# EAGLE design LICL_Amplifier (EAGLE 9.2.1)
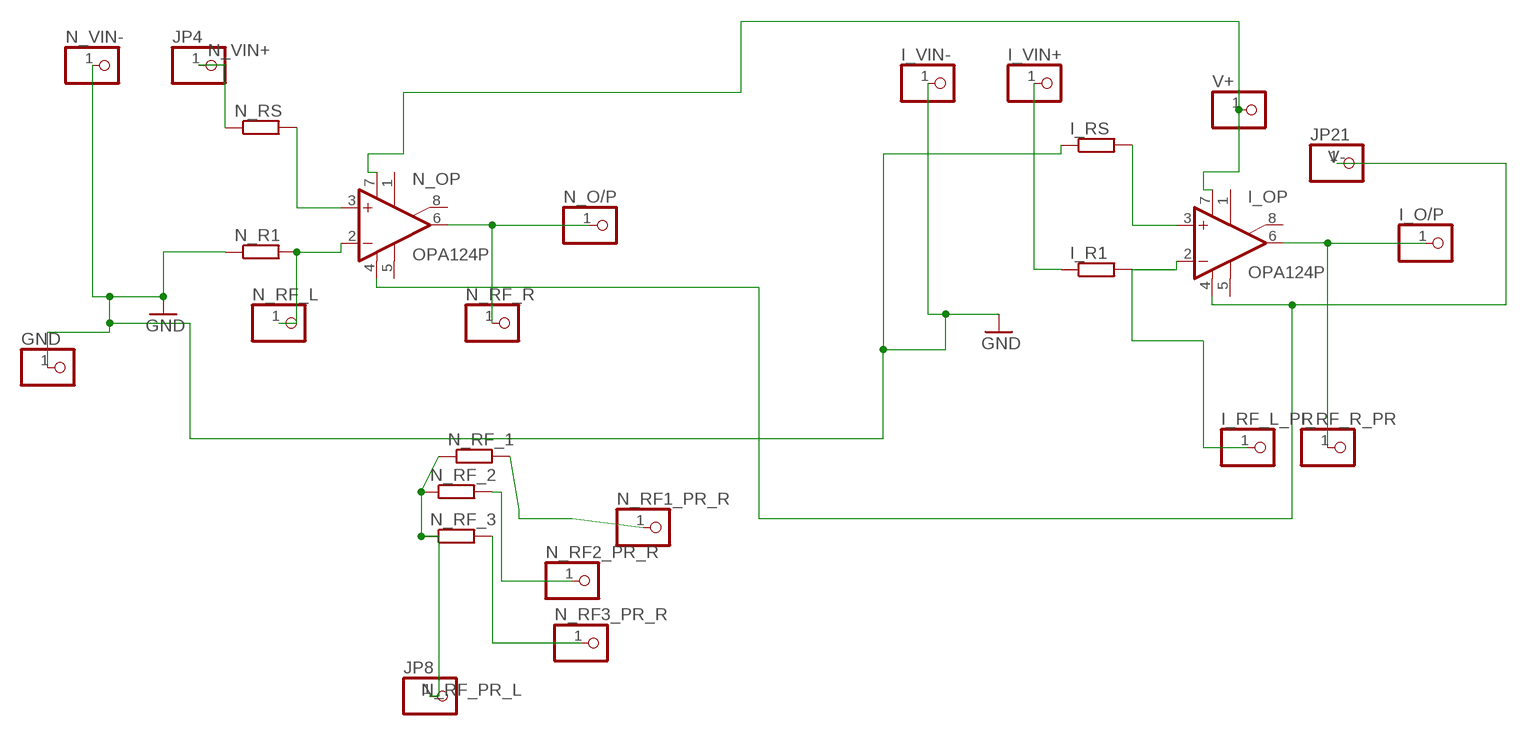
[diagram p0: schematic, sheet 1]

## Parts
GND  PINHD-1X1  [1X01]
I_O/P  PINHD-1X1  [1X01]
I_OP  OPA124P  [DIL08]
I_R1  R-EU_0207/10  [0207/10]
I_RF_L_PR  PINHD-1X1  [1X01]
I_RF_R_PR  PINHD-1X1  [1X01]
I_RS  R-EU_0207/10  [0207/10]
I_VIN+  PINHD-1X1  [1X01]
I_VIN-  PINHD-1X1  [1X01]
JP4  PINHD-1X1  [1X01]
JP8  PINHD-1X1  [1X01]
JP21  PINHD-1X1  [1X01]
N_O/P  PINHD-1X1  [1X01]
N_OP  OPA124P  [DIL08]
N_R1  R-EU_0207/10  [0207/10]
N_RF1_PR_R  PINHD-1X1  [1X01]
N_RF2_PR_R  PINHD-1X1  [1X01]
N_RF3_PR_R  PINHD-1X1  [1X01]
N_RF_1  R-EU_0207/10  [0207/10]
N_RF_2  R-EU_0207/10  [0207/10]
N_RF_3  R-EU_0207/10  [0207/10]
N_RF_L  PINHD-1X1  [1X01]
N_RF_R  PINHD-1X1  [1X01]
N_RS  R-EU_0207/10  [0207/10]
N_VIN-  PINHD-1X1  [1X01]
V+  PINHD-1X1  [1X01]

## Nets
GND: GND.1 I_RS.1 I_VIN-.1 N_R1.1 N_VIN-.1
N$1: N_OP.3(+IN) N_RS.2
N$4: N_O/P.1 N_OP.6(OUT) N_RF_R.1
N$5: N_RF1_PR_R.1 N_RF_1.2
N$6: N_RF2_PR_R.1 N_RF_2.2
N$7: N_RF3_PR_R.1 N_RF_3.2
N$8: I_OP.7(V+) N_OP.7(V+) V+.1
N$11: I_OP.3(+IN) I_RS.2
N$12: I_R1.1 I_VIN+.1
N$13: I_OP.2(-IN) I_R1.2 I_RF_L_PR.1
N$14: I_O/P.1 I_OP.6(OUT) I_RF_R_PR.1
N_RF_L: N_OP.2(-IN) N_R1.2 N_RF_L.1
N_RF_PR_L: JP8.1 N_RF_1.1 N_RF_2.1 N_RF_3.1
N_VIN+: JP4.1 N_RS.1
V-: I_OP.4(V-) JP21.1 N_OP.4(V-)
Unconnected: I_OP.1(TRIM1) I_OP.5(TRIM2) I_OP.8(SUBS) N_OP.1(TRIM1) N_OP.5(TRIM2) N_OP.8(SUBS)

## Library data of the parts
GND I_O/P I_RF_L_PR I_RF_R_PR I_VIN+ I_VIN- JP4 JP8 JP21 N_O/P N_RF1_PR_R N_RF2_PR_R N_RF3_PR_R N_RF_L N_RF_R N_VIN- V+ = pinhead:PINHD-1X1: PIN HEADER
I_OP N_OP = burr-brown:OPA124: Difet Operational Amplifier Low Noise, Precision; OC_FARNELL: unknown; OC_NEWARK: unknown
I_R1 I_RS N_R1 N_RF_1-N_RF_3 N_RS = resistor:R-EU_: RESISTOR, European symbol

## Board
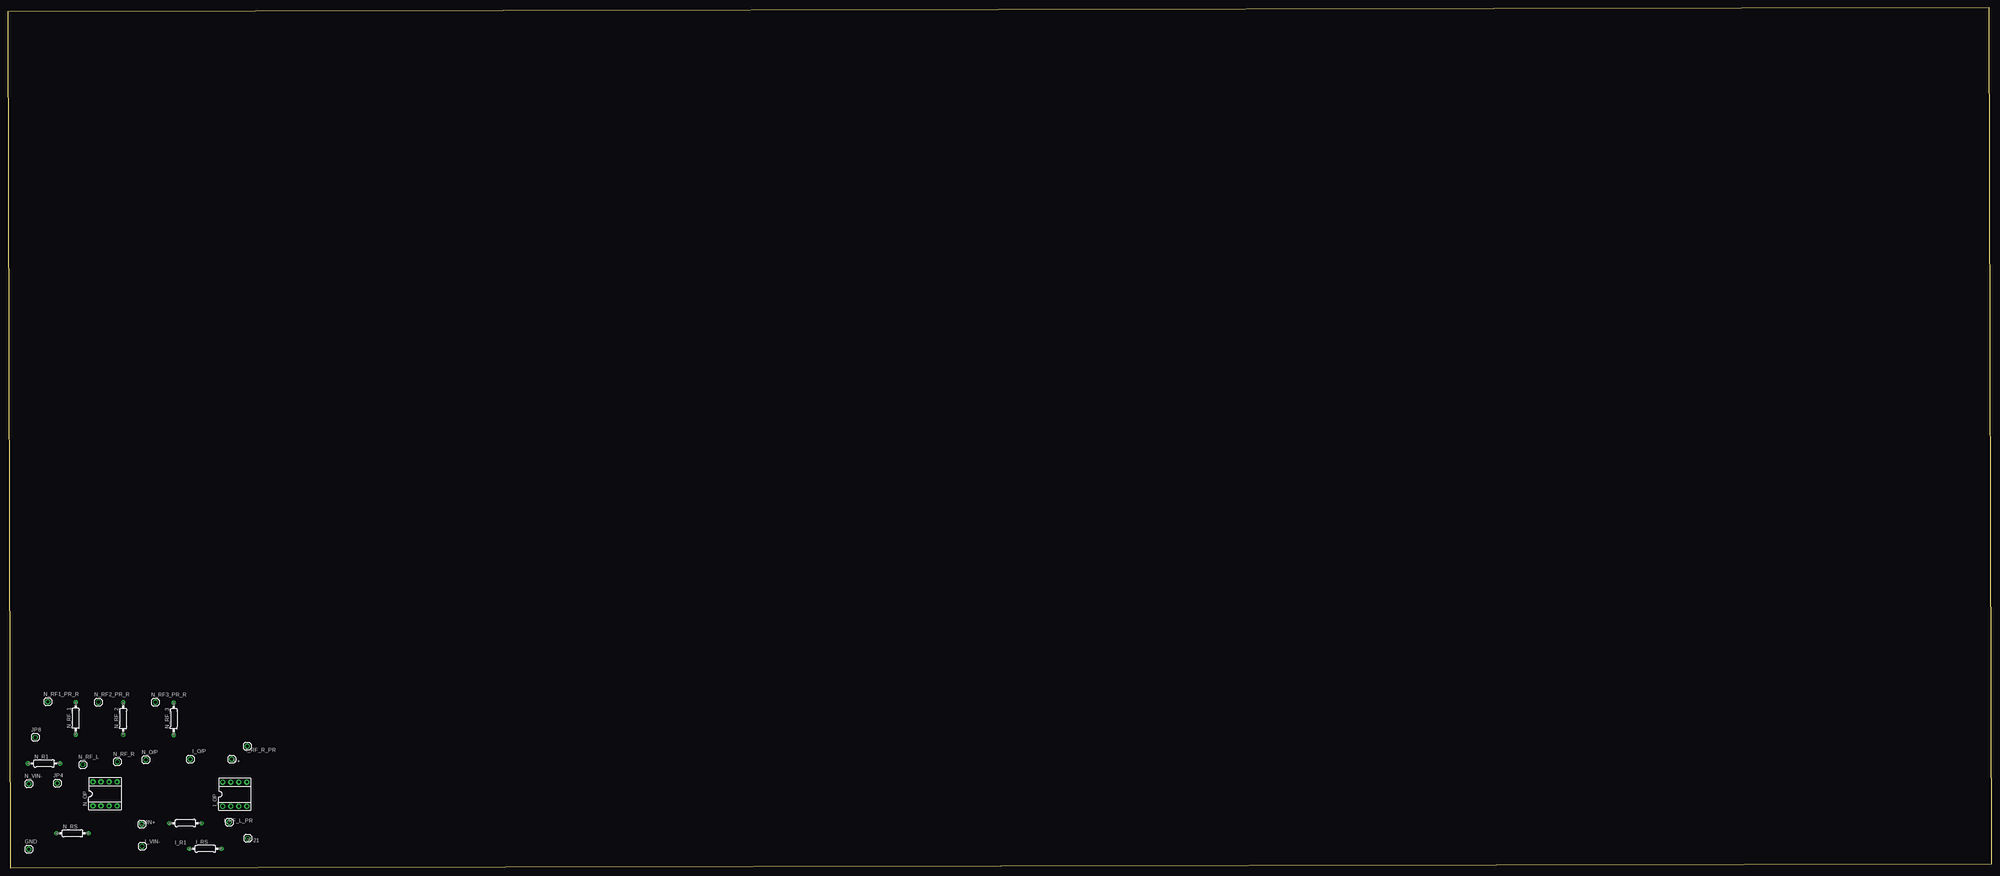
[diagram p1: board, top side]
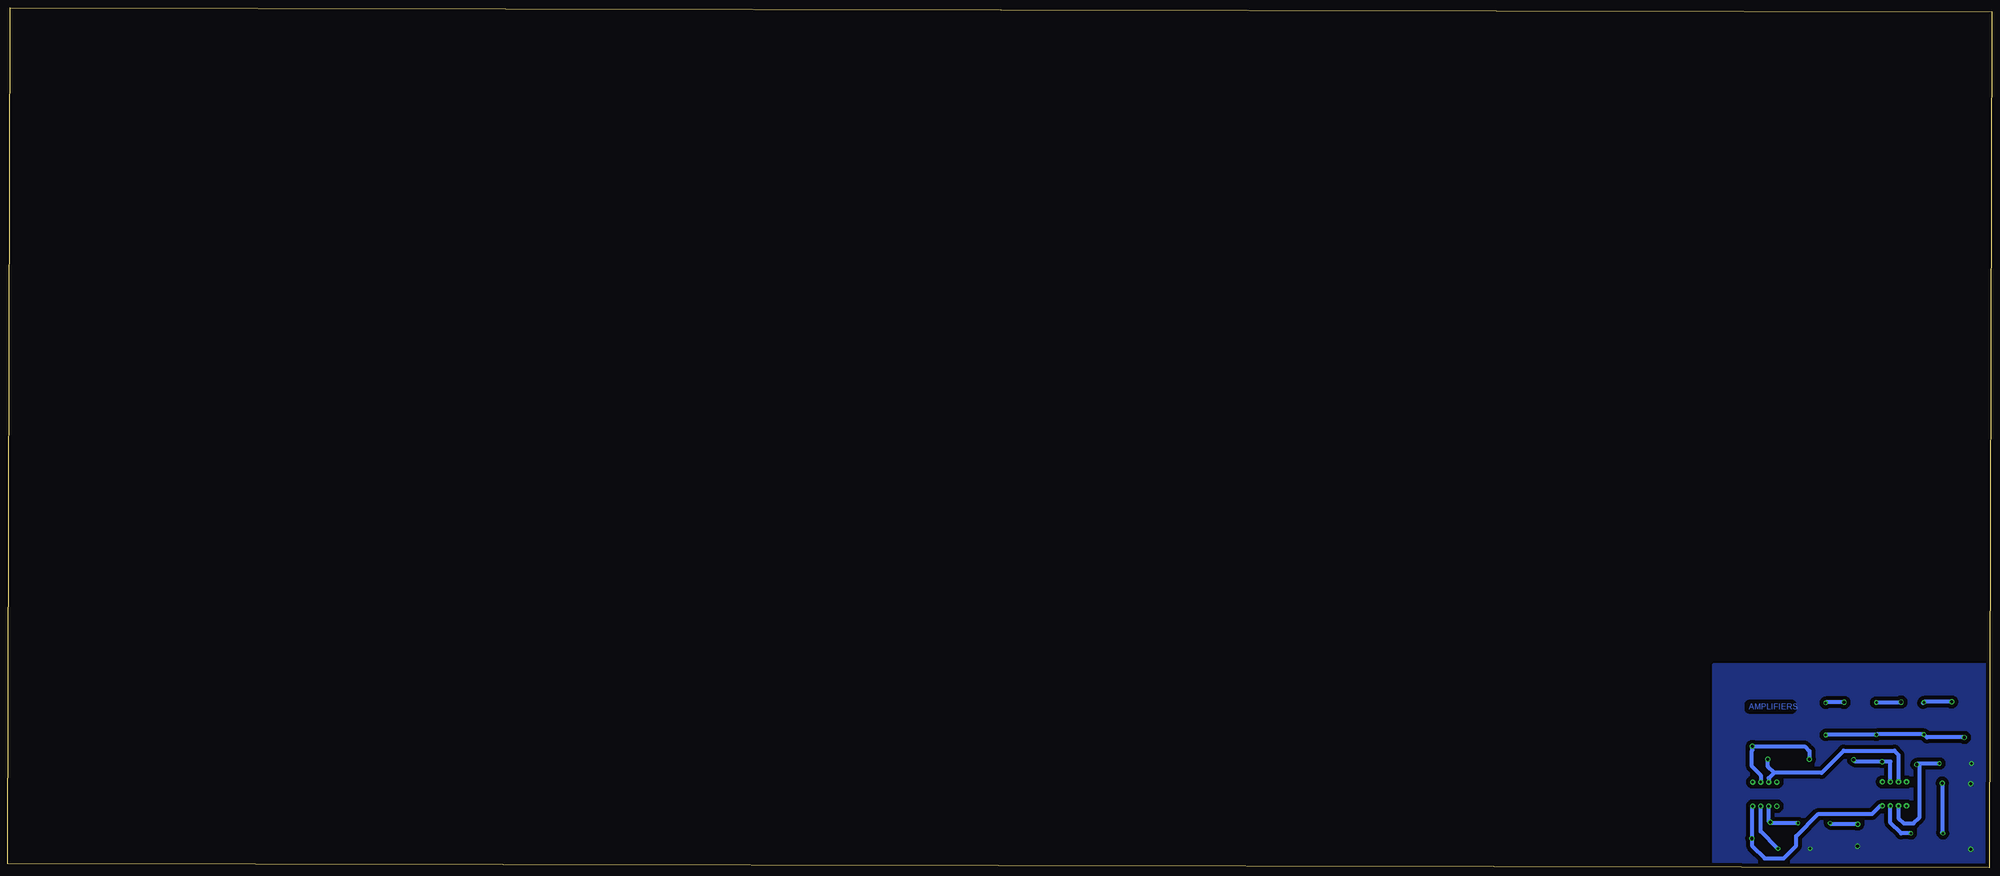
[diagram p2: board, bottom side, seen from below]

Size 626.82 x 271.64 mm. Coordinates in mm from the lower left corner, seen from the top.
Outline: 0.73,0 626.82,1.27 626.09,271.64 0,270.37 0.73,0
Copper layers (1*16): Top 0.035mm / dielectric 1.5mm / Bottom 0.035mm
Design rules "default": minimum track width 6mil, minimum drill 0.35mm, track to track 6mil, track to pad 6mil, pad to pad 6mil, via to via 6mil, smd to smd 6mil, copper to edge 40mil, drill to drill 6mil, minimum pad ring 10mil, minimum via ring 8mil, stop-mask expansion 4mil, vias tented up to drill 0mil, thermal gap 10mil

### Footprints (pad centres in the part's own frame; a part is rotated, then mirrored left to right if it is on the bottom)
1X01 = drill 1.016 octagon: 1 0,0
DIL08 = drill 0.813 pad 1.6 octagon: 1 -3.81,-3.81; 2 -1.27,-3.81; 3 1.27,-3.81; 4 3.81,-3.81; 5 3.81,3.81; 6 1.27,3.81; 7 -1.27,3.81; 8 -3.81,3.81
0207/10 = drill 0.813 octagon: 1 -5.08,0; 2 5.08,0

### Placement (x,y rotation side)
GND  6.6,5.86 0 top
I_O/P  57.6,34.27 0 top
I_OP  71.68,23.24 0 top
I_R1  56.11,14.11 0 top
I_RF_L_PR  69.92,14.35 0 top
I_RF_R_PR  75.6,38.35 0 top
I_RS  62.41,6.03 0 top
I_VIN+  42.3,13.78 0 top
I_VIN-  42.38,6.78 0 top
JP4  15.6,26.74 0 top
JP8  8.6,41.18 0 top
JP21  75.76,9.27 0 top
N_O/P  43.6,34.1 0 top
N_OP  30.68,23.35 0 top
N_R1  11.41,32.95 0 top
N_RF1_PR_R  12.6,52.42 0 top
N_RF2_PR_R  28.6,52.34 0 top
N_RF3_PR_R  46.6,52.26 0 top
N_RF_1  21.41,47.19 90 top
N_RF_2  36.41,47.11 90 top
N_RF_3  52.41,47.03 90 top
N_RF_L  23.6,32.61 0 top
N_RF_R  34.6,33.5 0 top
N_RS  20.41,10.87 0 top
N_VIN-  6.6,26.58 0 top
V+  70.68,34.27 0 top

### Tracks (layer width: path | path; a pad name or v marks a point on that pad's centre or on a via)
GND
  pour Bottom (isolate 1.27): 0.73,1 0.73,64 87.73,64 87.73,1
N$1
  Bottom 1.27: N_RS.2 28.6,10.87 31.95,14.22 N_OP.3
N$4
  Bottom 1.27: N_OP.6 31.95,33.5 N_RF_R.1 43,33.5 N_O/P.1
N$5
  Bottom 1.27: N_RF1_PR_R.1 21.31,52.42 21.46,52.27 | 21.73,52 21.46,52.27 | 21.46,52.27 N_RF_1.2
N$6
  Bottom 1.27: N_RF2_PR_R.1 28.75,52.19 N_RF_2.2
N$7
  Bottom 1.27: N_RF3_PR_R.1 52.26,52.26 N_RF_3.2
N$8
  Bottom 1.27: N_OP.7 29.41,35.68 30.73,37 46.73,37 53.73,30 68.73,30 | 68.73,30 70.41,28.32 I_OP.7 | 68.73,30 70.68,31.95 V+.1
N$11
  Bottom 1.27: I_RS.2 72.95,11.49 I_OP.3
N$12
  Bottom 1.27: I_VIN+.1 50.7,13.78 I_R1.1
N$13
  Bottom 1.27: I_R1.2 69.68,14.11 I_RF_L_PR.1 70.41,14.84 I_OP.2
N$14
  Bottom 1.27: I_OP.6 72.95,29.22 75.73,32 75.73,37 75.6,37.13 I_RF_R_PR.1 59.08,38.35 57.6,36.87 I_O/P.1
N_RF_L
  Bottom 1.27: N_OP.2 29.41,15.68 27.73,14 24.73,14 22.73,16 22.73,32.61 N_RF_L.1 23.26,32.95 N_R1.2
N_RF_PR_L
  Bottom 1.27: JP8.1 20.48,41.18 N_RF_1.1 36.33,42.11 N_RF_2.1 52.33,42.03 N_RF_3.1
N_VIN+
  Bottom 1.27: JP4.1 15.6,11.14 N_RS.1
V-
  Bottom 1.27: I_OP.4 75.76,19.16 JP21.1 75.76,7.03 71.73,3 65.73,3 61.73,7 61.73,10 54.73,17 37.73,17 35.19,19.54 N_OP.4

### Text on the board
Bottom: AMPLIFIERS